# Altium schematic sheet OLED.SchDoc
size A
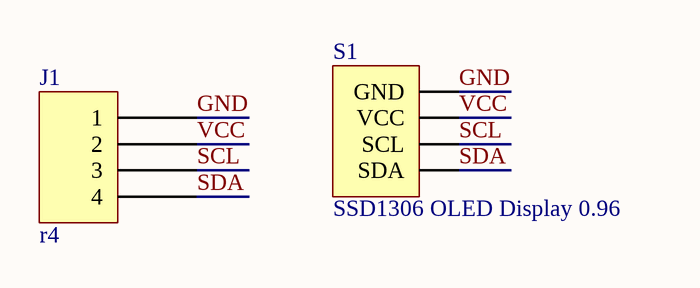
[diagram p0: OLED.SchDoc]

## Parts
J1  r4  [MOLEX SDA-70553-4PIN]
S1  SSD1306 OLED Display 0.96  [OLED]

## Nets
GND: J1.1 S1.1(GND)
SCL: J1.3 S1.3(SCL)
SDA: J1.4 S1.4(SDA)
VCC: J1.2 S1.2(VCC)

## Library data of the parts
S1 = OLED